# Altium project IBC_prijamnik_VB.PrjPcb
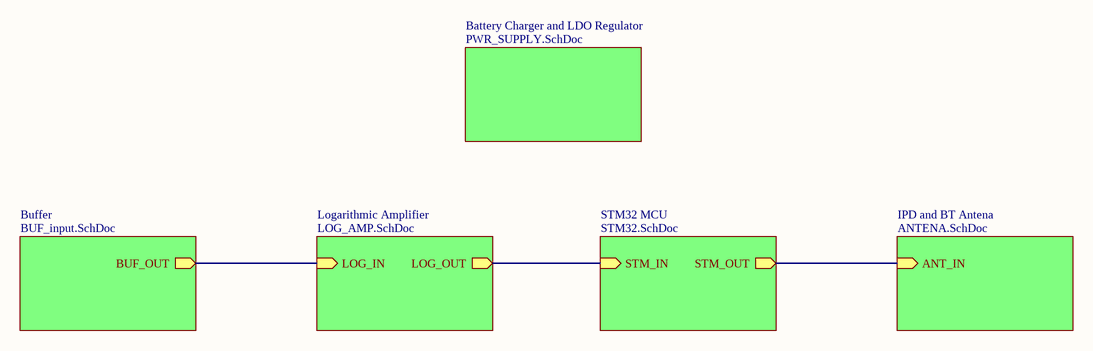
[diagram p0: MainSheet.SchDoc]
6 sheets, 81 parts. Net scope: hierarchical (ports join the sheet entries above them; power ports are global).
Board file: IBC_prijamnik_VB_ver2.PcbDoc
Sheets:
  MainSheet.SchDoc
    Battery Charger and LDO Regulator = PWR_SUPPLY.SchDoc
    IPD and BT Antena = ANTENA.SchDoc
    STM32 MCU = STM32.SchDoc
    Logarithmic Amplifier = LOG_AMP.SchDoc
    Buffer = BUF_input.SchDoc

## Sheet MainSheet.SchDoc
size A4; SheetNumber: 1; SheetTotal: 6

### Sub-sheets
Battery Charger and LDO Regulator = PWR_SUPPLY.SchDoc: no entries
Buffer = BUF_input.SchDoc: BUF_OUT (out)
IPD and BT Antena = ANTENA.SchDoc: ANT_IN (in)
Logarithmic Amplifier = LOG_AMP.SchDoc: LOG_OUT (out), LOG_IN (in)
STM32 MCU = STM32.SchDoc: STM_OUT (out), STM_IN (in)

### Nets
NetC6_1: sheet Logarithmic Amplifier/LOG_IN, sheet Buffer/BUF_OUT
NetIPD1_A3: sheet IPD and BT Antena/ANT_IN, sheet STM32 MCU/STM_OUT
NetR17_1: sheet STM32 MCU/STM_IN, sheet Logarithmic Amplifier/LOG_OUT

## Sheet PWR_SUPPLY.SchDoc
size A4; SheetNumber: 3; SheetTotal: 6
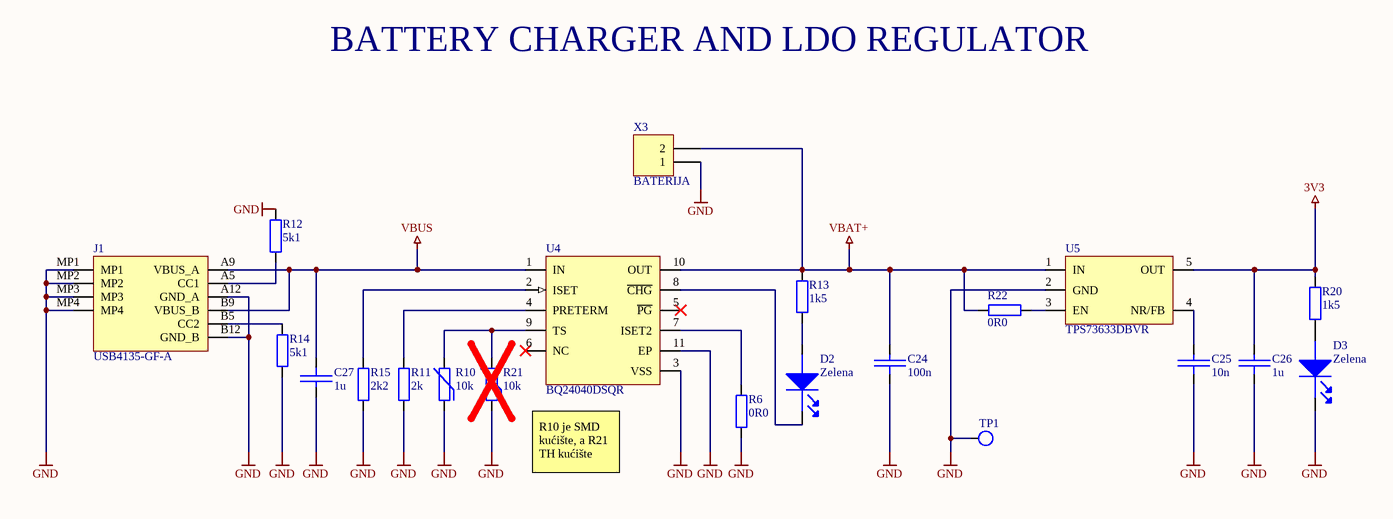
[diagram p1: PWR_SUPPLY.SchDoc]

### Parts
C24  100n  [0805]
C25  10n  [0805]
C26  1u  [0603]
C27  1u  [0603]
D2  Zelena  [0805]
D3  Zelena  [0805]
J1  USB4135-GF-A  [USB4135GFA]
R6  0R0  [0603]
R10  10k  [0402]
R11  2k  [0805]
R12  5k1  [0603]
R13  1k5  [0805]
R14  5k1  [0603]
R15  2k2  [0805]
R20  1k5  [0805]
R21  10k  [TH NTC]
R22  0R0  [0603]
TP1  TEST_POINT  [TST_POINT]  (value not drawn)  (no BOM)
U4  BQ24040DSQR  [WSON-10]
U5  TPS73633DBVR  [SOT23 5pin]
X3  BATERIJA  [BATTERY]  (no BOM)

### Nets
3V3: C26.2 R20.2 U5.5(OUT)
GND: C24.1 C25.1 C26.1 C27.2 D3.1(Cathode) J1.A12(GND_A) J1.B12(GND_B) J1.MP1 J1.MP2 J1.MP3 J1.MP4 R6.1 R10.1 R11.1 R12.2 R14.1 R15.1 R21.1 TP1.1 U4.3(VSS) U4.11(EP) U5.2(GND) X3.1
VBAT+: C24.2 R13.1 R22.2 U4.10(OUT) U5.1(IN) X3.2
VBUS: C27.1 J1.A9(VBUS_A) J1.B9(VBUS_B) U4.1(IN)
NetC25_2: C25.2 U5.4(NR/FB)
NetD2_1: D2.1(Cathode) U4.8(~{CHG})
NetD2_2: D2.2(Anode) R13.2
NetD3_2: D3.2(Anode) R20.1
NetJ1_A5: J1.A5(CC1) R12.1
NetJ1_B5: J1.B5(CC2) R14.2
NetR6_2: R6.2 U4.7(ISET2)
NetR10_2: R10.2 R21.2 U4.9(TS)
NetR11_2: R11.2 U4.4(PRETERM)
NetR15_2: R15.2 U4.2(ISET)
NetR22_1: R22.1 U5.3(EN)

Not connected (* = marked no-connect by the designer): U4 5(~{PG})* 6(NC)*

### Notes on the sheet
- BATTERY CHARGER AND LDO REGULATOR
- R10 je SMD kućište, a R21 TH kućište

### Library data of the parts
C24 = MCJCU21GBB7104KTPA01: Kondenzator, X7R, 10%, 50VDC; Manufacturer: TDK; Manufacturer Part Number: C2012X7R1H104K125AE; Capacitance: 100nF; Value: 100nF; Supplier 1: Mouser; Case/Package: 0805; ComponentLink1Description: https://datasheet.ciiva.com/29534/mlcc-commercial-soft-en-29534235.pdf?src-supplier=Digi-Key; Supplier Part Number 1: 963-MCJCU21GBB7104KT; Category: Ceramic Capacitors; Supplier 2: Mouser; Supplier Part Number 2: 810-C2012X7R1H104KAE; Kučište: 0805
C25 = C0805C103K5RECAUTO: Kondenzator, C0G, 10%, 50VDC; Manufacturer: KEMET; Capacitance: 10nF; Value: 10nF; Supplier 1: Mouser; Manufacturer Part Number: C0805C103K5RECAUTO; Case/Package: 0805; ComponentLink1Description: http://www.farnell.com/datasheets/2723804.pdf?src-supplier=Farnell; Supplier Part Number 1: 80-C0805C103K5RECAUT; Category: Ceramic Capacitors; Kučište: 0805
C26 C27 = C1608X7R1H105K080AB: Kondenzator, X7R, 10%, 50VDC; Manufacturer: TDK; Value: 1µF; Dielectric Material: Ceramic; Voltage Rating (DC): 50V; Supplier: DigiKey; Supplier Part Number: 445-C1608X7R1H105K080ABCT-ND; Manufacturer Part Number: C1608X7R1H105K080AB; Category: Ceramic Capacitors; Stock: 9450; Pricing: 1=0.21, 10=0.121, 50=0.0866, 100=0.076, 500=0.05824, 1000=0.05277 (USD); Height: 800µm; Length: 1.6mm; Lifecycle Status: Production; Max Operating Temperature: 125°C; Min Operating Temperature: -55°C; Mounting Technology: Surface Mount; Number of Terminals: 2; Width: 800µm; ComponentLink1URL: https://datasheet.octopart.com:443/C1608X7R1H105K080AB-TDK-datasheet-175423548.pdf?src-supplier=IHS; ComponentLink1Description: https://datasheet.octopart.com:443/C1608X7R1H105K080AB-TDK-datasheet-175423548.pdf?src-supplier=IHS; Kučište: 0603; Case/Package: 0603
D2 D3 = SM0805GCL: Dioda, svjetleća, 1,9V; Manufacturer: Bivar; Supplier 1: Mouser; Manufacturer Part Number: SM0805GCL; Category: LEDs; Case/Package: 0805; ComponentLink1Description: https://datasheet.ciiva.com/16487/sm0805gcl-16487554.pdf?src-supplier=Future+Electronics; Supplier Part Number 1: 749-SM0805GCL; Kučište: 0805
J1 = USB4135-GF-A: USB-C priključak; Manufacturer_Name: GCT (GLOBAL CONNECTOR TECHNOLOGY); Geometry.Height: 3.5mm; Manufacturer_Part_Number: USB4135-GF-A; Mouser Part Number: 640-USB4135-GF-A; Mouser Price/Stock: https://www.mouser.co.uk/ProductDetail/GCT/USB4135-GF-A?qs=Li%252BoUPsLEnt6HRo6RUvaXA%3D%3D; Arrow Part Number: *; Arrow Price/Stock: *; Datasheet Link: https://ar.mouser.com/datasheet/2/837/usb4135-2930399.pdf; Supplier 1: Farnell; Supplier Part Number 1: 3946920; Case/Package: SMD-10, 11,14x6,78mm
R6 R22 = CRCW06030000Z0EA: Otpornik, 1%, 100mW; Kučište: 0402; Supplier 1: Farnell; Supplier Part Number 1: MCMR04X000 PTL
  R6: Case/Package: 0402
  R22: Case/Package: 0603
R10 = NTCG103JF103FT1: NTC Termistor, 1%; Kučište: 0402; Supplier 1: Farnell; Supplier Part Number 1: NTCG103JF103FT1S; Case/Package: 0402
R11 = RC0805FR-102KL: Otpornik, 1%, 125mW; Manufacturer: Yageo; Supplier 1: Mouser; Manufacturer Part Number: RC0805FR-102KL; Supplier Part Number 1: 603-RC0805FR-102KL; Category: Resistors; Kučište: 0805; Case/Package: 0805
R12 R14 = MCT06030C5101FPW00: Otpornik, ±100ppm/C, 100mW; Manufacturer: Yageo Group; Manufacturer Part Number: AC0603FR-075K1L; Value: 5.1kΩ; Temperature Coefficient: 100ppm/°C; Tolerance: 1%; Voltage Rating: 75V; Supplier: RS; Supplier Part Number: 1978087; RoHS: Compliant; Category: Chip SMD Resistors; Stock: 3500; Pricing: 500=0.005, 2500=0.005, 5000=0.004, 7500=0.004, 10000=0.004 (GBP); Case/Package: 0603; Case Code (Imperial): 0603; Case Code (Metric): 1608; China RoHS: Non-Compliant; Composition: Thick Film; Features: Automotive AEC-Q200, Moisture Resistant; Height: 450µm; Length: 1.6mm; Lifecycle Status: Production; Max Operating Temperature: 155°C; Max Power Dissipation: 100mW; Min Operating Temperature: -55°C; Mounting Technology: Surface Mount; Number of Terminals: 2; Number of Terminations: 2; Packaging: Tape & Reel; Power Dissipation: 100mW; Power Rating: 100mW; REACH SVHC: Yes; Schedule B: 8533210045, 8533210045|8533210045|8533210045|8533210045|8533210045|8533210045|8533210045|8533210045|8533210045|8533210045|8533210045|8533210045|8533210045|8533210045|8533210045|8533210045|8533210045|8533210045|8533210045|8533210045|8533210045|8533210045|8533210045|85; Termination: SMD/SMT; Weight: 2.012816mg; Width: 800µm; Working Voltage: 75V; ComponentLink1URL: https://datasheet.octopart.com:443/AC0603FR-075K1L-Yageo-datasheet-182189377.pdf?src-supplier=IHS; ComponentLink1Description: https://datasheet.octopart.com:443/AC0603FR-075K1L-Yageo-datasheet-182189377.pdf?src-supplier=IHS; ComponentLink2URL: https://datasheet.octopart.com:443/AC0603FR-075K1L-Yageo-datasheet-86786639.pdf?src-supplier=Upverter; ComponentLink2Description: https://datasheet.octopart.com:443/AC0603FR-075K1L-Yageo-datasheet-86786639.pdf?src-supplier=Upverter; ComponentLink3URL: https://datasheet.octopart.com:443/AC0603FR-075K1L-Yageo-datasheet-178509465.pdf?src-supplier=Newark; ComponentLink3Description: https://datasheet.octopart.com:443/AC0603FR-075K1L-Yageo-datasheet-178509465.pdf?src-supplier=Newark; ComponentLink4URL: https://datasheet.octopart.com:443/AC0603FR-075K1L-Yageo-datasheet-151884373.pdf?src-supplier=Future+Electronics; ComponentLink4Description: https://datasheet.octopart.com:443/AC0603FR-075K1L-Yageo-datasheet-151884373.pdf?src-supplier=Future+Electronics; ComponentLink5URL: https://datasheet.octopart.com:443/AC0603FR-075K1L-Yageo-datasheet-166720450.pdf?src-supplier=Future+Electronics; ComponentLink5Description: https://datasheet.octopart.com:443/AC0603FR-075K1L-Yageo-datasheet-166720450.pdf?src-supplier=Future+Electronics; ComponentLink6URL: https://datasheet.octopart.com:443/AC0603FR-075K1L-Yageo-datasheet-137699919.pdf?src-supplier=Future+Electronics; ComponentLink6Description: https://datasheet.octopart.com:443/AC0603FR-075K1L-Yageo-datasheet-137699919.pdf?src-supplier=Future+Electronics; ComponentLink7URL: https://datasheet.octopart.com:443/AC0603FR-075K1L-Yageo-datasheet-128679721.pdf?src-supplier=X-ON; ComponentLink7Description: https://datasheet.octopart.com:443/AC0603FR-075K1L-Yageo-datasheet-128679721.pdf?src-supplier=X-ON; ComponentLink8URL: https://datasheet.octopart.com/AC0603FR-075K1L-Yageo-datasheet-12512238.pdf; ComponentLink8Description: https://datasheet.octopart.com/AC0603FR-075K1L-Yageo-datasheet-12512238.pdf; ComponentLink9URL: https://datasheet.octopart.com:443/AC0603FR-075K1L-Yageo-Group-datasheet-190301926.pdf?src-supplier=element14+APAC; ComponentLink9Description: https://datasheet.octopart.com:443/AC0603FR-075K1L-Yageo-Group-datasheet-190301926.pdf?src-supplier=element14+APAC; ComponentLink10URL: http://sigma.octopart.com:80/conflict_mineral_statement/Yageo-company-3.pdf?src-supplier=Compliance+Statements; ComponentLink10Description: http://sigma.octopart.com:80/conflict_mineral_statement/Yageo-company-3.pdf?src-supplier=Compliance+Statements; ComponentLink11URL: http://sigma.octopart.com:80/rohs_statement/Yageo-company-2.pdf?src-supplier=Compliance+Statements; ComponentLink11Description: http://sigma.octopart.com:80/rohs_statement/Yageo-company-2.pdf?src-supplier=Compliance+Statements; Supplier 1: RS; Supplier Part Number 1: 1978087; Kučište: 0603
R13 R20 = MCU08050C1501FP5: Otpornik, ±50ppm/C, 100mW; ComponentLink5URL: https://datasheet.octopart.com:443/CRCW12061K50JNEA-Vishay-datasheet-21226360.pdf?src-supplier=Newark; ComponentLink5Description: https://datasheet.octopart.com:443/CRCW12061K50JNEA-Vishay-datasheet-21226360.pdf?src-supplier=Newark; ComponentLink8URL: https://datasheet.octopart.com:443/CRCW12061K50JNEA-Vishay-datasheet-24897302.pdf?src-supplier=Farnell; ComponentLink8Description: https://datasheet.octopart.com:443/CRCW12061K50JNEA-Vishay-datasheet-24897302.pdf?src-supplier=Farnell; ComponentLink9URL: https://datasheet.octopart.com:443/CRCW12061K50JNEA-Vishay-datasheet-62316122.pdf?src-supplier=Future+Electronics; ComponentLink9Description: https://datasheet.octopart.com:443/CRCW12061K50JNEA-Vishay-datasheet-62316122.pdf?src-supplier=Future+Electronics; ComponentLink10URL: https://datasheet.octopart.com:443/CRCW12061K50JNEA-Vishay-datasheet-5300368.pdf?src-supplier=Future+Electronics; ComponentLink10Description: https://datasheet.octopart.com:443/CRCW12061K50JNEA-Vishay-datasheet-5300368.pdf?src-supplier=Future+Electronics; ComponentLink11URL: https://datasheet.octopart.com:443/CRCW12061K50JNEA-Vishay-datasheet-137115460.pdf?src-supplier=X-ON; ComponentLink11Description: https://datasheet.octopart.com:443/CRCW12061K50JNEA-Vishay-datasheet-137115460.pdf?src-supplier=X-ON; ComponentLink12URL: https://datasheet.octopart.com:443/CRCW12061K50JNEA-Vishay-Dale-datasheet-47688880.pdf?src-supplier=RS+(Formerly+Allied+Electronics); ComponentLink12Description: https://datasheet.octopart.com:443/CRCW12061K50JNEA-Vishay-Dale-datasheet-47688880.pdf?src-supplier=RS+(Formerly+Allied+Electronics); ComponentLink13URL: https://datasheet.octopart.com:443/CRCW12061K50JNEA-Vishay-datasheet-12001583.pdf?src-supplier=RS+(Formerly+Allied+Electronics); ComponentLink13Description: https://datasheet.octopart.com:443/CRCW12061K50JNEA-Vishay-datasheet-12001583.pdf?src-supplier=RS+(Formerly+Allied+Electronics); ComponentLink14URL: https://datasheet.octopart.com:443/CRCW12061K50JNEA-Vishay-datasheet-5306405.pdf?src-supplier=RS+(Formerly+Allied+Electronics); ComponentLink14Description: https://datasheet.octopart.com:443/CRCW12061K50JNEA-Vishay-datasheet-5306405.pdf?src-supplier=RS+(Formerly+Allied+Electronics); ComponentLink15URL: https://datasheet.octopart.com:443/CRCW12061K50JNEA-Vishay-datasheet-11540273.pdf?src-supplier=Arrow+Electronics; ComponentLink15Description: https://datasheet.octopart.com:443/CRCW12061K50JNEA-Vishay-datasheet-11540273.pdf?src-supplier=Arrow+Electronics; ComponentLink16URL: https://datasheet.octopart.com:443/CRCW12061K50JNEA-Vishay-datasheet-8445837.pdf?src-supplier=element14; ComponentLink16Description: https://datasheet.octopart.com:443/CRCW12061K50JNEA-Vishay-datasheet-8445837.pdf?src-supplier=element14; ComponentLink17URL: https://datasheet.octopart.com:443/CRCW12061K50JNEA-Vishay-datasheet-5377184.pdf?src-supplier=Garrett; ComponentLink17Description: https://datasheet.octopart.com:443/CRCW12061K50JNEA-Vishay-datasheet-5377184.pdf?src-supplier=Garrett; ComponentLink18URL: https://datasheet.octopart.com:443/CRCW12061K50JNEA-Vishay-datasheet-148188.pdf?src-supplier=Garrett; ComponentLink18Description: https://datasheet.octopart.com:443/CRCW12061K50JNEA-Vishay-datasheet-148188.pdf?src-supplier=Garrett; ComponentLink19URL: https://datasheet.octopart.com:443/CRCW12061K50JNEA-Vishay-datasheet-41916.pdf?src-supplier=Garrett; ComponentLink19Description: https://datasheet.octopart.com:443/CRCW12061K50JNEA-Vishay-datasheet-41916.pdf?src-supplier=Garrett; ComponentLink20URL: http://sigma.octopart.com:80/rohs_statement/Vishay-company-15.pdf?src-supplier=Compliance+Statements; ComponentLink20Description: http://sigma.octopart.com:80/rohs_statement/Vishay-company-15.pdf?src-supplier=Compliance+Statements; Supplier 1: Farnell; Supplier Part Number 1: MCU08050C1501FP500; Parameter 1: *; Kučište: 0805; Case/Package: 0805
R15 = MCU08050C2201FP5: Otpornik, ±100ppm/C, 125mW; Manufacturer: Panasonic; Manufacturer Part Number: ERJ-PB6B2201V; Manufacturer Lifecycle Status: ACTIVE; Part Series: High Precision Thick Film Chip Resistors; Max Power Dissipation: 250mW; Value: 2.2kΩ; Temperature Coefficient: 50ppm/°C; Tolerance: 0.1%; Voltage Rating (DC): 150V; Supplier: Farnell; Supplier Part Number: 4541375; RoHS: Compliant; Category: Chip SMD Resistors; Stock: 4030; Pricing: 10=0.0861, 100=0.0757, 500=0.0585, 1000=0.0534, 2500=0.0478, 5000=0.0422 (GBP); Case/Package: 0805; Case Code (Imperial): 0805; Case Code (Metric): 2012; Composition: Thick Film; Country of Origin: Japan; Export Control Classification Number (ECCN) Code: EAR99; Features: Automotive AEC-Q200; Height: 600µm; Height - Seated (Max): 711.2µm; Harmonized Tariff Schedule (HTS) Code: 8533.21.00.30; Introduction Date: 2016-02-25; Length: 2mm; Lifecycle Status: Production; Max Operating Temperature: 155°C; Min Operating Temperature: -55°C; Mounting Technology: Surface Mount; Number of Terminals: 2; Number of Terminations: 2; Power Dissipation: 250mW; Power Rating: 250mW; REACH SVHC: Yes; Schedule B: 8533210045, 8533210045|8533210045|8533210045|8533210045|8533210045; Width: 1.25mm; Working Voltage: 150V; ComponentLink1URL: https://datasheet.octopart.com:443/ERJ-PB6B2201V-Panasonic-datasheet-82522998.pdf?src-supplier=Panasonic; ComponentLink1Description: https://datasheet.octopart.com:443/ERJ-PB6B2201V-Panasonic-datasheet-82522998.pdf?src-supplier=Panasonic; ComponentLink2URL: https://datasheet.octopart.com:443/ERJPB6B2201V-Panasonic-datasheet-176289525.pdf?src-supplier=TME; ComponentLink2Description: https://datasheet.octopart.com:443/ERJPB6B2201V-Panasonic-datasheet-176289525.pdf?src-supplier=TME; ComponentLink3URL: https://sigma.octopart.com:443/150570796/technical_drawing/Panasonic-ERJPB6B2201V.pdf?src-supplier=Panasonic+SCT; ComponentLink3Description: https://sigma.octopart.com:443/150570796/technical_drawing/Panasonic-ERJPB6B2201V.pdf?src-supplier=Panasonic+SCT; ComponentLink4URL: https://datasheet.octopart.com:443/ERJPB6B2201V-Panasonic-datasheet-177212511.pdf?src-supplier=Burklin+Elektronik; ComponentLink4Description: https://datasheet.octopart.com:443/ERJPB6B2201V-Panasonic-datasheet-177212511.pdf?src-supplier=Burklin+Elektronik; Supplier 1: Farnell; Supplier Part Number 1: 4541375; Supplier 2: Farnell; Supplier Part Number 2: MCU08050C2201FP500; Kučište: 0805
R21 = 954-103AT-2: NTC Termistor, 1%; Supplier 1: DigiKey; Supplier Part Number 1: 4316-103AT-2-ND; Case/Package: TH-2, 3,7x2,54 mm
U4 = BQ24040DSQR: Li-Ion baterija, 800mA; Manufacturer_Name: Texas Instruments; Datasheet Link: http://www.ti.com/lit/gpn/bq24040; Height: 0.8mm; Manufacturer_Part_Number: BQ24040DSQR; Mouser Part Number: 595-BQ24040DSQR; Mouser Price/Stock: https://www.mouser.co.uk/ProductDetail/Texas-Instruments/BQ24040DSQR?qs=c7TMWs5treTJYvOlVMq%252B%2Fw%3D%3D; Arrow Part Number: BQ24040DSQR; Arrow Price/Stock: https://www.arrow.com/en/products/bq24040dsqr/texas-instruments?utm_currency=USD&region=nac; Supplier 1: Arrow Electronics; Supplier Part Number 1: BQ24040DSQR; Case/Package: WSON-10
U5 = TPS73633DBVR: IC Regulator, 3,3V, 400mADC; Manufacturer: Texas Instruments; Supplier 1: Mouser; Manufacturer Part Number: TPS73633DBVR; Category: Voltage Regulators - Linear; Case/Package: SOT-23; ComponentLink1Description: https://datasheet.ciiva.com/41462/001015026-da-01-en-ic-reg-ldo-3-3v-0-tps73633dbvr-sot-5-tid-41462871.pdf?src-supplier=Conrad; Supplier Part Number 1: 595-TPS73633DBVR
X3 = Header 2: Header, 2-Pin; LatestRevisionDate: 17-Jul-2002; LatestRevisionNote: Re-released for DXP Platform.; Publisher: Altium Limited

## Sheet ANTENA.SchDoc
size A4; SheetNumber: 6; SheetTotal: 5
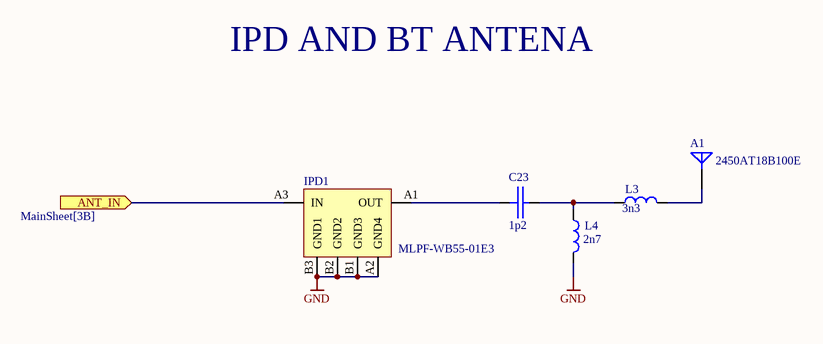
[diagram p2: ANTENA.SchDoc]

### Parts
A1  2450AT18B100E  [ANT_2450AT18B100E]
C23  1p2  [0402]
IPD1  MLPF-WB55-01E3  [IPD]
L3  3n3  [0402]
L4  2n7  [0402]

### Ports
ANT_IN (in, see MainSheet[3B])

### Nets
GND: IPD1.A2(GND4) IPD1.B1(GND3) IPD1.B2(GND2) IPD1.B3(GND1) L4.2
NetA1_1: A1.1 L3.2
NetC23_1: C23.1 IPD1.A1(OUT)
NetC23_2: C23.2 L3.1 L4.1
NetIPD1_A3: IPD1.A3(IN) ; port ANT_IN

### Notes on the sheet
- IPD AND BT ANTENA

### Library data of the parts
A1 = 2450AT18B100E: Antena, 2.45GHz; Manufacturer: Johanson; Supplier 1: Mouser; Manufacturer Part Number: 2450AT18B100E; Category: RF Antennas; Case/Package: SMD-2, 3,8x1,8mm; ComponentLink1Description: https://datasheet.ciiva.com/24025/antenna-2450at18b100-242422-24025839.pdf?src-supplier=Mouser; Supplier Part Number 1: 609-2450AT18B100E
C23 = 609-QSCF500Q1R2B1GV0: Kondenzator, C0G, 10%, 50VDC; Manufacturer: Johanson; Manufacturer Part Number: 500R07S1R2BV4T; Capacitance: 1.2pF; Value: 1.2pF; Supplier 1: Mouser; Category: Ceramic Capacitors; Case/Package: 0402; ComponentLink1Description: https://datasheet.ciiva.com/1461/1731432-1461669.pdf?src-supplier=Element14; Supplier Part Number 1: 609-500R07S1R2BV4T; Supplier 2: Arrow Electronics; Supplier Part Number 2: 500R07S1R2BV4T; Case: 0402
IPD1 = MLPF-WB55-01E3: RF Filtar, 2.4-2.5GHz; Manufacturer: STMicroelectronics; Supplier 1: Mouser; Manufacturer Part Number: MLPF-WB55-01E3; ComponentLink1Description: http://www.farnell.com/datasheets/2802556.pdf?src-supplier=Farnell; Supplier Part Number 1: 511-MLPF-WB55-01E3; Category: Integrated Passive Device; Case/Package: SMD-6, 1,6x1 mm
L3 = BSCH1005053N3SCS: Zavojnica, neoklopljena, 400mADC; Manufacturer: Johanson; Manufacturer Part Number: L-07C3N3SV6T; Value: 3.3nH; Supplier 1: Mouser; Supplier Part Number 1: 609-L-07C3N3SV6T; Category: Fixed Inductors; Case/Package: 0402; Supplier 2: Farnell; Supplier Part Number 2: 3773633; Kučište: 0402
L4 = LRC0402CS2N7GV001T: RF zavojnica, neoklopljena, 300mADC; Manufacturer: Johanson; Manufacturer Part Number: L-07C2N7SV6T; Value: 2.7nH; Supplier 1: Mouser; Category: Fixed Inductors; Case/Package: 0402; ComponentLink1Description: https://datasheet.ciiva.com/1473/1168792-1473898.pdf?src-supplier=Element14; Supplier Part Number 1: 609-L-07C2N7SV6T; Supplier 2: DigiKey; Supplier Part Number 2: 712-LRC0402CS2N7GV001TCT-ND; Kučište: 0402

## Sheet STM32.SchDoc
size A4; SheetNumber: 5; SheetTotal: 6
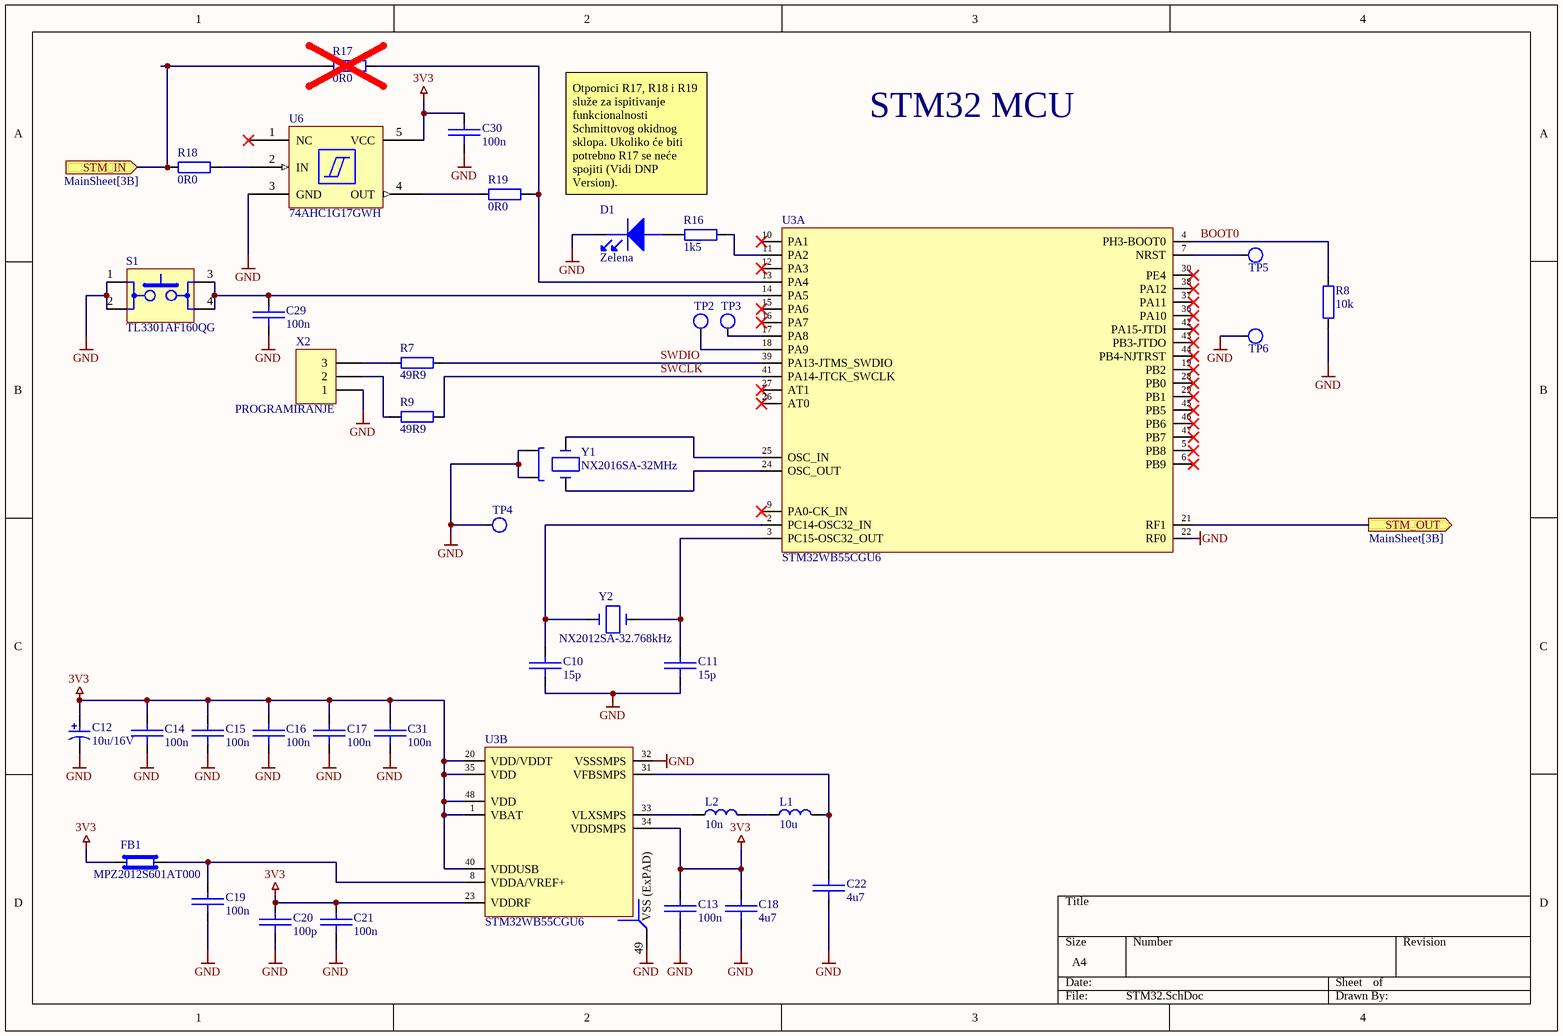
[diagram p3: STM32.SchDoc]

### Parts
C10  15p  [0805]
C11  15p  [0805]
C12  10u/16V  [1210]
C13  100n  [0805]
C14  100n  [0805]
C15  100n  [0805]
C16  100n  [0805]
C17  100n  [0805]
C18  4u7  [0805]
C19  100n  [0805]
C20  100p  [0402]
C21  100n  [0805]
C22  4u7  [0805]
C29  100n  [0805]
C30  100n  [0805]
C31  100n  [0805]
D1  Zelena  [0805]
FB1  MPZ2012S601AT000  [0805]
L1  10u  [0805]
L2  10n  [0805]
R7  49R9  [0805]
R8  10k  [0805]
R9  49R9  [0805]
R16  1k5  [0805]
R17  0R0  [0603]
R18  0R0  [0603]
R19  0R0  [0603]
S1  TL3301AF160QG  [SOP400P1000X525-4N]
TP2  TEST_POINT  [TST_POINT]  (value not drawn)  (no BOM)
TP3  TEST_POINT  [TST_POINT]  (value not drawn)  (no BOM)
TP4  TEST_POINT  [TST_POINT]  (value not drawn)  (no BOM)
TP5  TEST_POINT  [TST_POINT]  (value not drawn)  (no BOM)
TP6  TEST_POINT  [TST_POINT]  (value not drawn)  (no BOM)
U3  STM32WB55CGU6  [STM32]  (parts A,B of 2)
U6  74AHC1G17GWH  [SOT353-1]
X2  PROGRAMIRANJE  [HDR1X3]
Y1  NX2016SA-32MHz  [NX2016_4P]
Y2  NX2012SA-32.768kHz  [0805]

### Ports
STM_IN (in, see MainSheet[3B]), STM_OUT (out, see MainSheet[3B])

### Nets
3V3: C12.1 C13.2 C14.2 C15.2 C16.2 C17.2 C18.2 C20.2 C21.2 C30.2 C31.2 FB1.1 U3.1(VBAT) U3.20(VDD/VDDT) U3.23(VDDRF) U3.34(VDDSMPS) U3.35(VDD) U3.40(VDDUSB) U3.48(VDD) U6.5(VCC)
GND: C10.1 C11.1 C12.2 C13.1 C14.1 C15.1 C16.1 C17.1 C18.1 C19.1 C20.1 C21.1 C22.1 C29.1 C30.1 C31.1 D1.1(Cathode) R8.2 S1.1 S1.2 TP4.1 TP6.1 U3.22(RF0) U3.32(VSSSMPS) U3.49(VSS_(ExPAD)) U6.3(GND) X2.1 Y1.2(GND) Y1.4(GND)
BOOT0: R8.1 U3.4(PH3-BOOT0)
SWCLK: R9.2 U3.41(PA14-JTCK_SWCLK)
SWDIO: R7.2 U3.39(PA13-JTMS_SWDIO)
NetC10_2: C10.2 U3.2(PC14-OSC32_IN) Y2.2
NetC11_2: C11.2 U3.3(PC15-OSC32_OUT) Y2.1
NetC19_2: C19.2 FB1.2 U3.8(VDDA/VREF+)
NetC22_2: C22.2 L1.2 U3.31(VFBSMPS)
NetC29_2: C29.2 S1.3 S1.4 U3.14(PA5)
NetD1_2: D1.2(Anode) R16.1
NetIPD1_A3: U3.21(RF1) ; port STM_OUT
NetL1_1: L1.1 L2.2
NetL2_1: L2.1 U3.33(VLXSMPS)
NetR7_1: R7.1 X2.3
NetR9_1: R9.1 X2.2
NetR16_2: R16.2 U3.11(PA2)
NetR17_1: R17.1 R18.1 ; port STM_IN
NetR17_2: R17.2 R19.2 U3.13(PA4)
NetR18_2: R18.2 U6.2(IN)
NetR19_1: R19.1 U6.4(OUT)
NetTP2_1: TP2.1 U3.18(PA9)
NetTP3_1: TP3.1 U3.17(PA8)
NetTP5_1: TP5.1 U3.7(NRST)
NetU3_24: U3.24(OSC_OUT) Y1.1
NetU3_25: U3.25(OSC_IN) Y1.3

Not connected (* = marked no-connect by the designer): U3 5(PB8)* 6(PB9)* 9(PA0-CK_IN)* 10(PA1)* 12(PA3)* 15(PA6)* 16(PA7)* 19(PB2)* 26(AT0)* 27(AT1)* 28(PB0)* 29(PB1)* 30(PE4)* 36(PA10)* 37(PA11)* 38(PA12)* 42(PA15-JTDI)* 43(PB3-JTDO)* 44(PB4-NJTRST)* 45(PB5)* 46(PB6)* 47(PB7)*; U6 1(NC)*

### Notes on the sheet
- STM32 MCU
- Otpornici R17, R18 i R19 služe za ispitivanje funkcionalnosti Schmittovog okidnog sklopa. Ukoliko će biti potrebno R17 se neće spojiti (Vidi DNP Version).

### Library data of the parts
C10 C11 = 08052U150JAT2A: Kondenzator, C0G, 10%, 160VDC; Manufacturer: Murata; Manufacturer Part Number: GRM21A5C2D150JW01D; Capacitance: 15pF; Value: 15pF; Supplier 1: Mouser; Category: Ceramic Capacitors; Case/Package: 0805; ComponentLink1Description: http://components.arrow.com/part/dataview/0323_07284744?src-supplier=Arrow+Europe; Supplier Part Number 1: 81-GRM21A5C2D150JW1D; Supplier 2: Mouser; Supplier Part Number 2: 581-08052U150J; Kučište: 0805
C12 = 581-THJB106K016SJN: Elektrolitski kondenzator, Ta, 10%, 16V; Supplier 1: DigiKey; Supplier Part Number 1: 478-13152-1-ND; Case/Package: 1210
C13-C17 C19 C21 C29-C31 = MCJCU21GBB7104KTPA01: as C24 on sheet PWR_SUPPLY; Supplier 1: Mouser; Case/Package: 0805; ComponentLink1Description: https://datasheet.ciiva.com/29534/mlcc-commercial-soft-en-29534235.pdf?src-supplier=Digi-Key; Supplier Part Number 1: 963-MCJCU21GBB7104KT; Category: Ceramic Capacitors; Supplier 2: Mouser; Supplier Part Number 2: 810-C2012X7R1H104KAE; Kučište: 0805
C18 C22 = CGA4J1X7R1H475K125AC: Kondenzator, C0G, 10%, 50VDC; Manufacturer: TDK; Capacitance: 4u7F; Value: 4u7F; Supplier 1: Mouser; Manufacturer Part Number: CGA4J1X7R1H475K125AC; ComponentLink1Description: https://product.tdk.com/info/en/catalog/datasheets/mlcc_automotive_general_en.pdf?src-supplier=Digi-Key; Supplier Part Number 1: 810-CGA4J1X7R1H475K1; Category: Ceramic Capacitors; Case/Package: 0805; Kučište: 0805
C20 = GCM1555C2A101GE02D: Kondenzator, C0G, 2%, 100VDC; Kučište: 0402; Supplier 1: DigiKey; Supplier Part Number 1: 490-GCM1555C2A101GE02DTR-ND; Case/Package: 0402
D1 = SM0805GCL: as D2 on sheet PWR_SUPPLY; Supplier 1: Mouser; Manufacturer Part Number: SM0805GCL; Category: LEDs; Case/Package: 0805; ComponentLink1Description: https://datasheet.ciiva.com/16487/sm0805gcl-16487554.pdf?src-supplier=Future+Electronics; Supplier Part Number 1: 749-SM0805GCL; Kučište: 0805
FB1 = MPZ2012S601AT000: Feritna perla, 600Ohm; Manufacturer: TDK; Supplier 1: Mouser; Manufacturer Part Number: MPZ2012S601AT000; Category: Inductors; Case/Package: 0805; ComponentLink1Description: https://datasheet.ciiva.com/46634/beads-commercial-power-mpz-en-46634335.pdf?src-supplier=Digi-Key; Supplier Part Number 1: 810-MPZ2012S601AT000; Kučište: 0805
L1 = LSQBA201212T100KR: Zavojnica, neoklopljena, 500mADC,; Manufacturer: Murata; Manufacturer Part Number: LQM21FN100M70L; Value: 10uH; Supplier 1: Avnet; Category: Fixed Inductors; Case/Package: 0805; ComponentLink1Description: https://datasheet.ciiva.com/18088/getdatasheetpartid-74214-18088963.pdf?src-supplier=Verical; Supplier Part Number 1: LQM21FN100M70L; Supplier 2: Mouser; Supplier Part Number 2: 81-LQM21FN100M70L; Kučište: 0805
L2 = AIMC-0805-10NJ-T: Zavojnica, neoklopljena, +/-5%, 300mADC; Manufacturer: Abracon; Value: 10nH; Power Dissipation: 62.5mW; Temperature Coefficient: 400ppm/°C; Voltage Rating: 50V; Supplier 1: Mouser; Manufacturer Part Number: AIMC-0805-10NJ-T; Category: Fixed Inductors; Case/Package: 0805; ComponentLink1Description: https://datasheet.octopart.com:443/MCMR04X000-PTL-Multicomp-datasheet-10850617.pdf?src-supplier=IHS; Supplier Part Number 1: 815-AIMC-0805-10NJT; Supplier: Farnell; Supplier Part Number: 2692041; RoHS: Compliant; Stock: 490000; Pricing: 10000=0.0033, 50000=0.0029 (GBP); Case Code (Imperial): 0402; Case Code (Metric): 1005; Composition: Ceramic; Contact Plating: Tin; Lifecycle Status: Production; Max Operating Temperature: 155°C; Min Operating Temperature: -55°C; Mounting Technology: Surface Mount; Number of Terminals: 2; Packaging: Cut Tape; Power Rating: 62.5mW; REACH SVHC: No; Voltage Rating (DC): 50V; ComponentLink1URL: https://datasheet.octopart.com:443/MCMR04X000-PTL-Multicomp-datasheet-10850617.pdf?src-supplier=IHS; ComponentLink2URL: https://datasheet.octopart.com:443/MCMR04X000-PTL-Multicomp-datasheet-99731353.pdf?src-supplier=Farnell; ComponentLink2Description: https://datasheet.octopart.com:443/MCMR04X000-PTL-Multicomp-datasheet-99731353.pdf?src-supplier=Farnell; ComponentLink3URL: https://datasheet.octopart.com:443/MCMR04X000-PTL-Multicomp-datasheet-15896274.pdf?src-supplier=Newark; ComponentLink3Description: https://datasheet.octopart.com:443/MCMR04X000-PTL-Multicomp-datasheet-15896274.pdf?src-supplier=Newark; Kučište: 0805
R7 R9 = AC0805FR-0749R9L: Otpornik, ±100ppm/C, 125mW; Manufacturer: Yageo; Value: 49,9; Supplier 1: Mouser; Manufacturer Part Number: AC0805FR-0749R9L; Category: Chip SMD Resistors; Case/Package: 0805; ComponentLink1Description: http://www.yageo.com/NewPortal/yageodocoutput?fileName=/pdf/R-Chip/PYu-AC_51_RoHS_L_6.pdf&src-supplier=Digi-Key; Supplier Part Number 1: 603-AC0805FR-0749R9L; Kučište: 0805
R8 = RC0805JR-0710KL: Otpornik, 5%, 125mW; Manufacturer: Yageo; Supplier 1: Mouser; Manufacturer Part Number: RC0805JR-0710KL; Category: Chip SMD Resistors; Case/Package: 0805; ComponentLink1Description: https://datasheet.ciiva.com/7983/444164-7983765.pdf?src-supplier=Element14; Supplier Part Number 1: 603-RC0805JR-0710KL; Value: 10k; Kučište: 0805
R16 = MCU08050C1501FP5: Otpornik, ±50ppm/C, 100mW; ComponentLink5URL: https://datasheet.octopart.com:443/CRCW12061K50JNEA-Vishay-datasheet-21226360.pdf?src-supplier=Newark; ComponentLink5Description: https://datasheet.octopart.com:443/CRCW12061K50JNEA-Vishay-datasheet-21226360.pdf?src-supplier=Newark; ComponentLink8URL: https://datasheet.octopart.com:443/CRCW12061K50JNEA-Vishay-datasheet-24897302.pdf?src-supplier=Farnell; ComponentLink8Description: https://datasheet.octopart.com:443/CRCW12061K50JNEA-Vishay-datasheet-24897302.pdf?src-supplier=Farnell; ComponentLink9URL: https://datasheet.octopart.com:443/CRCW12061K50JNEA-Vishay-datasheet-62316122.pdf?src-supplier=Future+Electronics; ComponentLink9Description: https://datasheet.octopart.com:443/CRCW12061K50JNEA-Vishay-datasheet-62316122.pdf?src-supplier=Future+Electronics; ComponentLink10URL: https://datasheet.octopart.com:443/CRCW12061K50JNEA-Vishay-datasheet-5300368.pdf?src-supplier=Future+Electronics; ComponentLink10Description: https://datasheet.octopart.com:443/CRCW12061K50JNEA-Vishay-datasheet-5300368.pdf?src-supplier=Future+Electronics; ComponentLink11URL: https://datasheet.octopart.com:443/CRCW12061K50JNEA-Vishay-datasheet-137115460.pdf?src-supplier=X-ON; ComponentLink11Description: https://datasheet.octopart.com:443/CRCW12061K50JNEA-Vishay-datasheet-137115460.pdf?src-supplier=X-ON; ComponentLink12URL: https://datasheet.octopart.com:443/CRCW12061K50JNEA-Vishay-Dale-datasheet-47688880.pdf?src-supplier=RS+(Formerly+Allied+Electronics); ComponentLink12Description: https://datasheet.octopart.com:443/CRCW12061K50JNEA-Vishay-Dale-datasheet-47688880.pdf?src-supplier=RS+(Formerly+Allied+Electronics); ComponentLink13URL: https://datasheet.octopart.com:443/CRCW12061K50JNEA-Vishay-datasheet-12001583.pdf?src-supplier=RS+(Formerly+Allied+Electronics); ComponentLink13Description: https://datasheet.octopart.com:443/CRCW12061K50JNEA-Vishay-datasheet-12001583.pdf?src-supplier=RS+(Formerly+Allied+Electronics); ComponentLink14URL: https://datasheet.octopart.com:443/CRCW12061K50JNEA-Vishay-datasheet-5306405.pdf?src-supplier=RS+(Formerly+Allied+Electronics); ComponentLink14Description: https://datasheet.octopart.com:443/CRCW12061K50JNEA-Vishay-datasheet-5306405.pdf?src-supplier=RS+(Formerly+Allied+Electronics); ComponentLink15URL: https://datasheet.octopart.com:443/CRCW12061K50JNEA-Vishay-datasheet-11540273.pdf?src-supplier=Arrow+Electronics; ComponentLink15Description: https://datasheet.octopart.com:443/CRCW12061K50JNEA-Vishay-datasheet-11540273.pdf?src-supplier=Arrow+Electronics; ComponentLink16URL: https://datasheet.octopart.com:443/CRCW12061K50JNEA-Vishay-datasheet-8445837.pdf?src-supplier=element14; ComponentLink16Description: https://datasheet.octopart.com:443/CRCW12061K50JNEA-Vishay-datasheet-8445837.pdf?src-supplier=element14; ComponentLink17URL: https://datasheet.octopart.com:443/CRCW12061K50JNEA-Vishay-datasheet-5377184.pdf?src-supplier=Garrett; ComponentLink17Description: https://datasheet.octopart.com:443/CRCW12061K50JNEA-Vishay-datasheet-5377184.pdf?src-supplier=Garrett; ComponentLink18URL: https://datasheet.octopart.com:443/CRCW12061K50JNEA-Vishay-datasheet-148188.pdf?src-supplier=Garrett; ComponentLink18Description: https://datasheet.octopart.com:443/CRCW12061K50JNEA-Vishay-datasheet-148188.pdf?src-supplier=Garrett; ComponentLink19URL: https://datasheet.octopart.com:443/CRCW12061K50JNEA-Vishay-datasheet-41916.pdf?src-supplier=Garrett; ComponentLink19Description: https://datasheet.octopart.com:443/CRCW12061K50JNEA-Vishay-datasheet-41916.pdf?src-supplier=Garrett; ComponentLink20URL: http://sigma.octopart.com:80/rohs_statement/Vishay-company-15.pdf?src-supplier=Compliance+Statements; ComponentLink20Description: http://sigma.octopart.com:80/rohs_statement/Vishay-company-15.pdf?src-supplier=Compliance+Statements; Parameter 1: *; Kučište: 0805; Supplier 1: Farnell; Supplier Part Number 1: MCU08050C1501FP500; Case/Package: 0805
R17-R19 = CRCW06030000Z0EA: Otpornik, 1%, 100mW; Kučište: 0402; Supplier 1: Farnell; Supplier Part Number 1: MCMR04X000 PTL; Case/Package: 0603
S1 = TL3301AF160QG: Taktilni prekidač; Manufacturer: E-Switch; Supplier 1: Mouser; Manufacturer Part Number: TL3301AF160QG; Category: Tactile Switches; ComponentLink1Description: https://datasheet.ciiva.com/2900/p010516d-2900775.pdf?src-supplier=Digi-Key; Supplier Part Number 1: 612-TL3301AF1; Case/Package: SMD-4, 6x6mm
U3 = STM32WB55CGU6: STM32 Mikrokontroler, 1,7-3,6V; Manufacturer: STMicroelectronics; Supplier 1: Mouser; Manufacturer Part Number: STM32WB55CGU6; ComponentLink1Description: http://www.farnell.com/datasheets/2792352.pdf?src-supplier=Farnell; Supplier Part Number 1: 511-STM32WB55CGU6; Category: Microcontroller; Case/Package: UFQFPN-48
U6 = 74AHC1G17GWH: Integrirani Schmittov okidni sklop; Kučište: 0805; Supplier 1: Farnell; Supplier Part Number 1: 74AHC1G17GWH; Case/Package: SOT353-1
X2 = Header 3: Header, 3-Pin; LatestRevisionDate: 17-Jul-2002; LatestRevisionNote: Re-released for DXP Platform.; Publisher: Altium Limited
Y1 = NX2012SA32768K1: Kristalni oscilator 32KHz; Manufacturer: NDK; Manufacturer Part Number: NX2016SA-32MHZ-EXS00A-CS10925; Kučište: 0805; Supplier 1: DigiKey; Supplier Part Number 1: 644-1375-1-ND; Category: Crystal; Supplier 2: Mouser; Supplier Part Number 2: 344-NX2016SA32S06465; Case/Package: 0805
Y2 = NX2012SA-32.768K-STD-MUB-1: Kristalni oscilator, 32.768KHz; Manufacturer: NDK; Manufacturer Part Number: NX2012SA-32.768KHZ-EXS00A-MU00626; Case/Package: 0805; Category: Crystal; Supplier 1: Mouser; Supplier Part Number 1: 344-NX2012SA32768K1; Kučište: 0805

## Sheet LOG_AMP.SchDoc
size A4; SheetNumber: 4; SheetTotal: 6
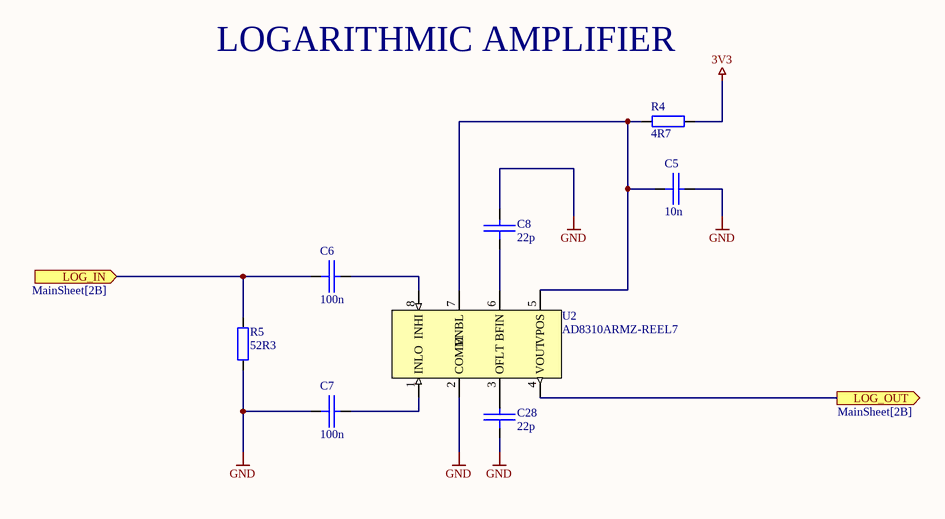
[diagram p4: LOG_AMP.SchDoc]

### Parts
C5  10n  [0805]
C6  100n  [0805]
C7  100n  [0805]
C8  22p  [0402]
C28  22p  [0402]
R4  4R7  [0805]
R5  52R3  [0805]
U2  AD8310ARMZ-REEL7  [MSOP]

### Ports
LOG_IN (in, see MainSheet[2B]), LOG_OUT (out, see MainSheet[2B])

### Nets
3V3: R4.2
GND: C5.2 C7.1 C8.2 C28.1 R5.1 U2.2(COMM)
NetC5_1: C5.1 R4.1 U2.5(VPOS) U2.7(ENBL)
NetC6_1: C6.1 R5.2 ; port LOG_IN
NetC6_2: C6.2 U2.8(INHI)
NetC7_2: C7.2 U2.1(INLO)
NetC8_1: C8.1 U2.6(BFIN)
NetC28_2: C28.2 U2.3(OFLT)
NetR17_1: U2.4(VOUT) ; port LOG_OUT

### Notes on the sheet
- LOGARITHMIC AMPLIFIER

### Library data of the parts
C5 = C0805C103K5RECAUTO: as C25 on sheet PWR_SUPPLY; Supplier 1: Mouser; Manufacturer Part Number: C0805C103K5RECAUTO; Case/Package: 0805; ComponentLink1Description: http://www.farnell.com/datasheets/2723804.pdf?src-supplier=Farnell; Supplier Part Number 1: 80-C0805C103K5RECAUT; Category: Ceramic Capacitors; Kučište: 0805
C6 C7 = MCJCU21GBB7104KTPA01: as C24 on sheet PWR_SUPPLY; Supplier 1: Mouser; Case/Package: 0805; ComponentLink1Description: https://datasheet.ciiva.com/29534/mlcc-commercial-soft-en-29534235.pdf?src-supplier=Digi-Key; Supplier Part Number 1: 963-MCJCU21GBB7104KT; Category: Ceramic Capacitors; Supplier 2: Mouser; Supplier Part Number 2: 810-C2012X7R1H104KAE; Kučište: 0805
C8 C28 = KAM05ACG1H220FH: Kondenzator, C0G, 1%, 50VDC; Supplier 1: Mouser; Supplier Part Number 1: 581-KAM05ACG1H220FH; Kučište: 0402; Case/Package: 0402
R4 = AC0805FR-074R7L: Otpornik, 1%, 125mW; Manufacturer: Yageo; Value: 4.7; Supplier 1: Mouser; Manufacturer Part Number: AC0805FR-074R7L; Category: Chip SMD Resistors; Case/Package: 0805; ComponentLink1Description: https://datasheet.ciiva.com/12577/pyu-ac-51-rohs-l-2-12577194.pdf?src-supplier=Mouser; Supplier Part Number 1: 603-AC0805FR-074R7L; Kučište: 0805
R5 = RC0805FR-0752R3L: Otpornik, 1%, 125mW; Manufacturer: Yageo; Value: 52.3; Case/Package: 0805; Category: Chip SMD Resistors; Manufacturer Part Number: RC0805FR-0752R3L; Supplier 1: Mouser; Supplier Part Number 1: 603-RC0805FR-0752R3L; Case: 0805; Kučište: *
U2 = AD8310ARMZ-REEL7: Logaritamsko pojačalo; Manufacturer: Analog Devices; Supplier 1: Mouser; Manufacturer Part Number: AD8310ARMZ-REEL7; Category: Amplifiers - Op Amps, Buffer, Instrumentation; Case/Package: MSOP; ComponentLink1Description: https://datasheet.ciiva.com/15128/getdatasheetpartid-243611-15128567.pdf?src-supplier=Verical; Supplier Part Number 1: 584-AD8310ARMZ-R7

## Sheet BUF_input.SchDoc
size A4; SheetNumber: 2; SheetTotal: 6
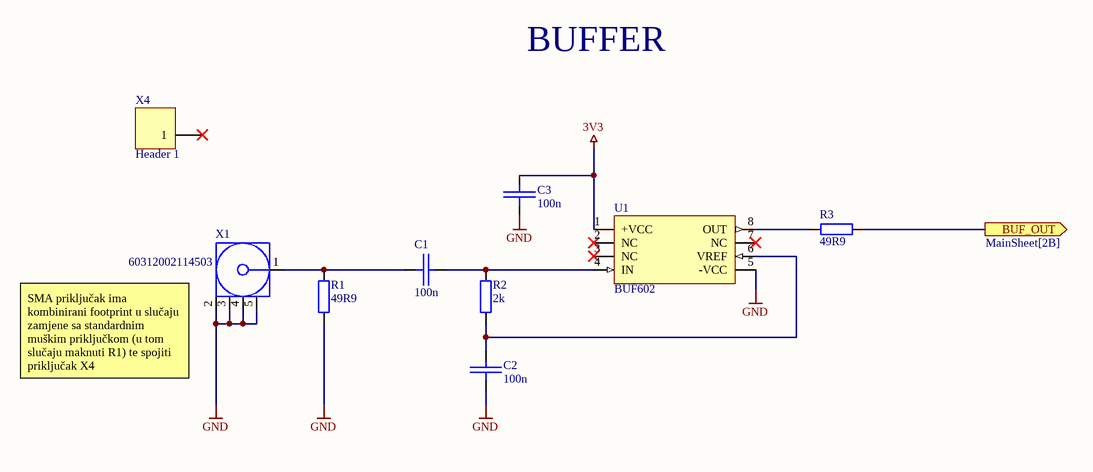
[diagram p5: BUF_input.SchDoc]

### Parts
C1  100n  [0805]
C2  100n  [0805]
C3  100n  [0805]
R1  49R9  [0805]
R2  2k  [0805]
R3  49R9  [0805]
U1  BUF602  [SOIC-8]
X1  60312002114503  [SMA]  (no BOM)
X4  Header 1  [HDR1X2]

### Ports
BUF_OUT (out, see MainSheet[2B])

### Nets
3V3: C3.2 U1.1(+VCC)
GND: C2.1 C3.1 R1.1 U1.5(-VCC) X1.2 X1.3 X1.4 X1.5
NetC1_1: C1.1 R1.2 X1.1
NetC1_2: C1.2 R2.2 U1.4(IN)
NetC2_2: C2.2 R2.1 U1.6(VREF)
NetC6_1: R3.2 ; port BUF_OUT
NetR3_1: R3.1 U1.8(OUT)

Not connected (* = marked no-connect by the designer): U1 2(NC)* 3(NC)* 7(NC)*; X4 1*

### Notes on the sheet
- BUFFER
- (near X1) SMA priključak ima kombinirani footprint u slučaju zamjene sa standardnim muškim priključkom (u tom slučaju maknuti R1) te spojiti priključak X4

### Library data of the parts
C1-C3 = MCJCU21GBB7104KTPA01: as C24 on sheet PWR_SUPPLY; Supplier 1: Mouser; Case/Package: 0805; ComponentLink1Description: https://datasheet.ciiva.com/29534/mlcc-commercial-soft-en-29534235.pdf?src-supplier=Digi-Key; Supplier Part Number 1: 963-MCJCU21GBB7104KT; Category: Ceramic Capacitors; Supplier 2: Mouser; Supplier Part Number 2: 810-C2012X7R1H104KAE; Kučište: 0805
R1 R3 = AC0805FR-0749R9L: as R7 on sheet STM32; Supplier 1: Mouser; Manufacturer Part Number: AC0805FR-0749R9L; Category: Chip SMD Resistors; Case/Package: 0805; ComponentLink1Description: http://www.yageo.com/NewPortal/yageodocoutput?fileName=/pdf/R-Chip/PYu-AC_51_RoHS_L_6.pdf&src-supplier=Digi-Key; Supplier Part Number 1: 603-AC0805FR-0749R9L; Kučište: 0805
R2 = RC0805FR-102KL: Otpornik, 1%, 125mW; Manufacturer: Yageo; Supplier 1: Mouser; Supplier Part Number 1: 603-RC0805FR-102KL; Kučište: 0805; Manufacturer Part Number: RC0805FR-102KL; Category: Resistors; Case/Package: 0805
U1 = BUF602: Integrirani Buffer; Manufacturer: Texas Instruments; Manufacturer Part Number: BUF602ID; Supplier 1: Mouser; Supplier Part Number 1: 595-BUF602ID; Category: Operational Amplifiers; Case/Package: SOIC-8
X1 = 60312002114503: SMA priključak; Manufacturer: Wurth Electronics; Supplier 1: Mouser; Manufacturer Part Number: 60312002114503; Supplier Part Number 1: 710-60312002114503; Category: SMA Connector
X4 = Header 2: Header, 1-Pin; LatestRevisionDate: 17-Jul-2002; LatestRevisionNote: Re-released for DXP Platform.; Publisher: Altium Limited

## Nets that join several sheets
3V3: PWR_SUPPLY (C26.2 R20.2 U5.5), STM32 (20 pins), LOG_AMP (R4.2), BUF_input (C3.2 U1.1)
GND: PWR_SUPPLY (23 pins), ANTENA (5 pins), STM32 (29 pins), LOG_AMP (6 pins), BUF_input (8 pins)
NetC6_1: LOG_AMP (C6.1 R5.2), BUF_input (R3.2)
NetIPD1_A3: ANTENA (IPD1.A3), STM32 (U3.21)
NetR17_1: STM32 (R17.1 R18.1), LOG_AMP (U2.4)

## Assembly variants
DNP Version: not fitted R17 R21